# Altium schematic sheet FMC_MISC.SchDoc: TEBF0808 - FMC
size A4; Organization: Trenz Electronic GmbH; DocumentNumber: TEBF0808; Revision: 04; SheetNumber: 19; SheetTotal: 36; Date: 2016-09-29; CompanyName: Trenz Electronic GmbH; ProjectName: TEB0808 - LAN9514
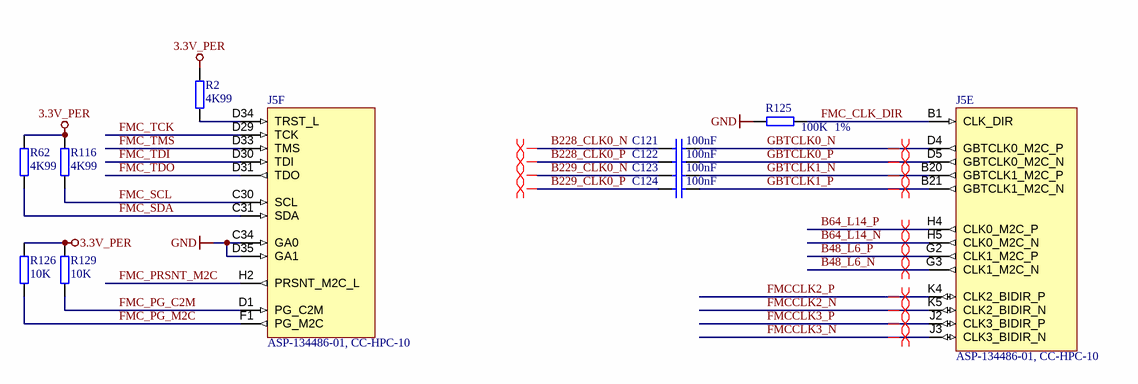
[diagram p0: FMC_MISC.SchDoc]

## Parts
C121  100nF  [CAPC0603X33N]
C122  100nF  [CAPC0603X33N]
C123  100nF  [CAPC0603X33N]
C124  100nF  [CAPC0603X33N]
J5  ASP-134486-01, CC-HPC-10  [ASP-134486-01B]  (parts E,F of 9)
R2  4K99  [RESC1005X40N]
R62  4K99  [RESC1005X40N]
R116  4K99  [RESC1005X40N]
R125  100K  Tolerance: 1%  [RESC1005X40N]
R126  10K  [RESC1005X40N]
R129  10K  [RESC1005X40N]

## Nets
3.3V_PER: R2.2 R62.2 R116.2 R126.2 R129.1
GND: J5.C34(GA0) J5.D35(GA1) R125.1
B48_L6_N: J5.G3(CLK1_M2C_N)
B48_L6_P: J5.G2(CLK1_M2C_P)
B64_L14_N: J5.H5(CLK0_M2C_N)
B64_L14_P: J5.H4(CLK0_M2C_P)
B228_CLK0_N: C121.1
B228_CLK0_P: C122.1
B229_CLK0_N: C123.1
B229_CLK0_P: C124.1
FMC_CLK_DIR: J5.B1(CLK_DIR) R125.2
FMC_PG_C2M: J5.D1(PG_C2M) R129.2
FMC_PG_M2C: J5.F1(PG_M2C) R126.1
FMC_PRSNT_M2C: J5.H2(PRSNT_M2C_L)
FMC_SCL: J5.C30(SCL) R116.1
FMC_SDA: J5.C31(SDA) R62.1
FMC_TCK: J5.D29(TCK)
FMC_TDI: J5.D30(TDI)
FMC_TDO: J5.D31(TDO)
FMC_TMS: J5.D33(TMS)
FMCCLK2_N: J5.K5(CLK2_BIDIR_N)
FMCCLK2_P: J5.K4(CLK2_BIDIR_P)
FMCCLK3_N: J5.J3(CLK3_BIDIR_N)
FMCCLK3_P: J5.J2(CLK3_BIDIR_P)
GBTCLK0_N: C121.2 J5.D4(GBTCLK0_M2C_P)
GBTCLK0_P: C122.2 J5.D5(GBTCLK0_M2C_N)
GBTCLK1_N: C123.2 J5.B20(GBTCLK1_M2C_P)
GBTCLK1_P: C124.2 J5.B21(GBTCLK1_M2C_N)
NetJ5_D34: J5.D34(TRST_L) R2.1

## Layout directives
differential pair: B48_L6_N, B48_L6_P, B64_L14_N, B64_L14_P, B228_CLK0_N, B228_CLK0_P, B229_CLK0_N, B229_CLK0_P, FMCCLK2_N, FMCCLK2_P, FMCCLK3_N, FMCCLK3_P, GBTCLK0_N, GBTCLK0_P, GBTCLK1_N, GBTCLK1_P

## Notes on the sheet
- Title:
- Number:
- Rev.
- Date:
- A4
- Copyright:
- Page
- of
- Filename:

## Library data of the parts
C121-C124 = 24915: KON 100nF 6.3V X5R SMD 10%; AN: 24915; Mixed: SMT; Value: 100n; Preferred: Yes; Voltage: 6.3V; Technology: X5R; Case: 0603 (0201); Tolerance: 10%
J5 = 24851: ASP-134486-01 female, CC-HPC-10; AN: 24851; Mixed: SMT; Trenz-Stock: Yes; HelpURL: B:\AD\adlib\datasheet\Samtec; H-ART: ASP-134486-01
R2 R62 R116 = 22754: WID SMD 4K99 1% 0,063W; AN: 22754; Value: 4.99K; Mixed: SMT; Preferred: Yes; Case: 1005 (0402); Tolerance: 1%; Technology: TK100
R125 = 22558: WID SMD 100K 1% 0,063W; AN: 22558; Mixed: SMT; Preferred: Yes; Case: 1005 (0402); Technology: TK100; Value: 100K
R126 R129 = 22750: WID SMD 10K 1% 0,063W; AN: 22750; Mixed: SMT; Preferred: Yes; Tolerance: 1%; Case: 1005 (0402); Technology: TK100; Value: 10K